# EasyEDA Pro project TJMakes_IO_Expander.eprj

# Schematic schematic1
Create Date: 2024-02-26; Page Name: P1; Project Name: TJMakes_IO_Expander; Schematic Name: schematic1; Update Date: 2024-02-26; Company: EasyEDA.com; Drawn: EasyEDA; Page Size: A4; Part Number: JLCPCB-002; Reviewed: EasyEDA; Version: V0.1
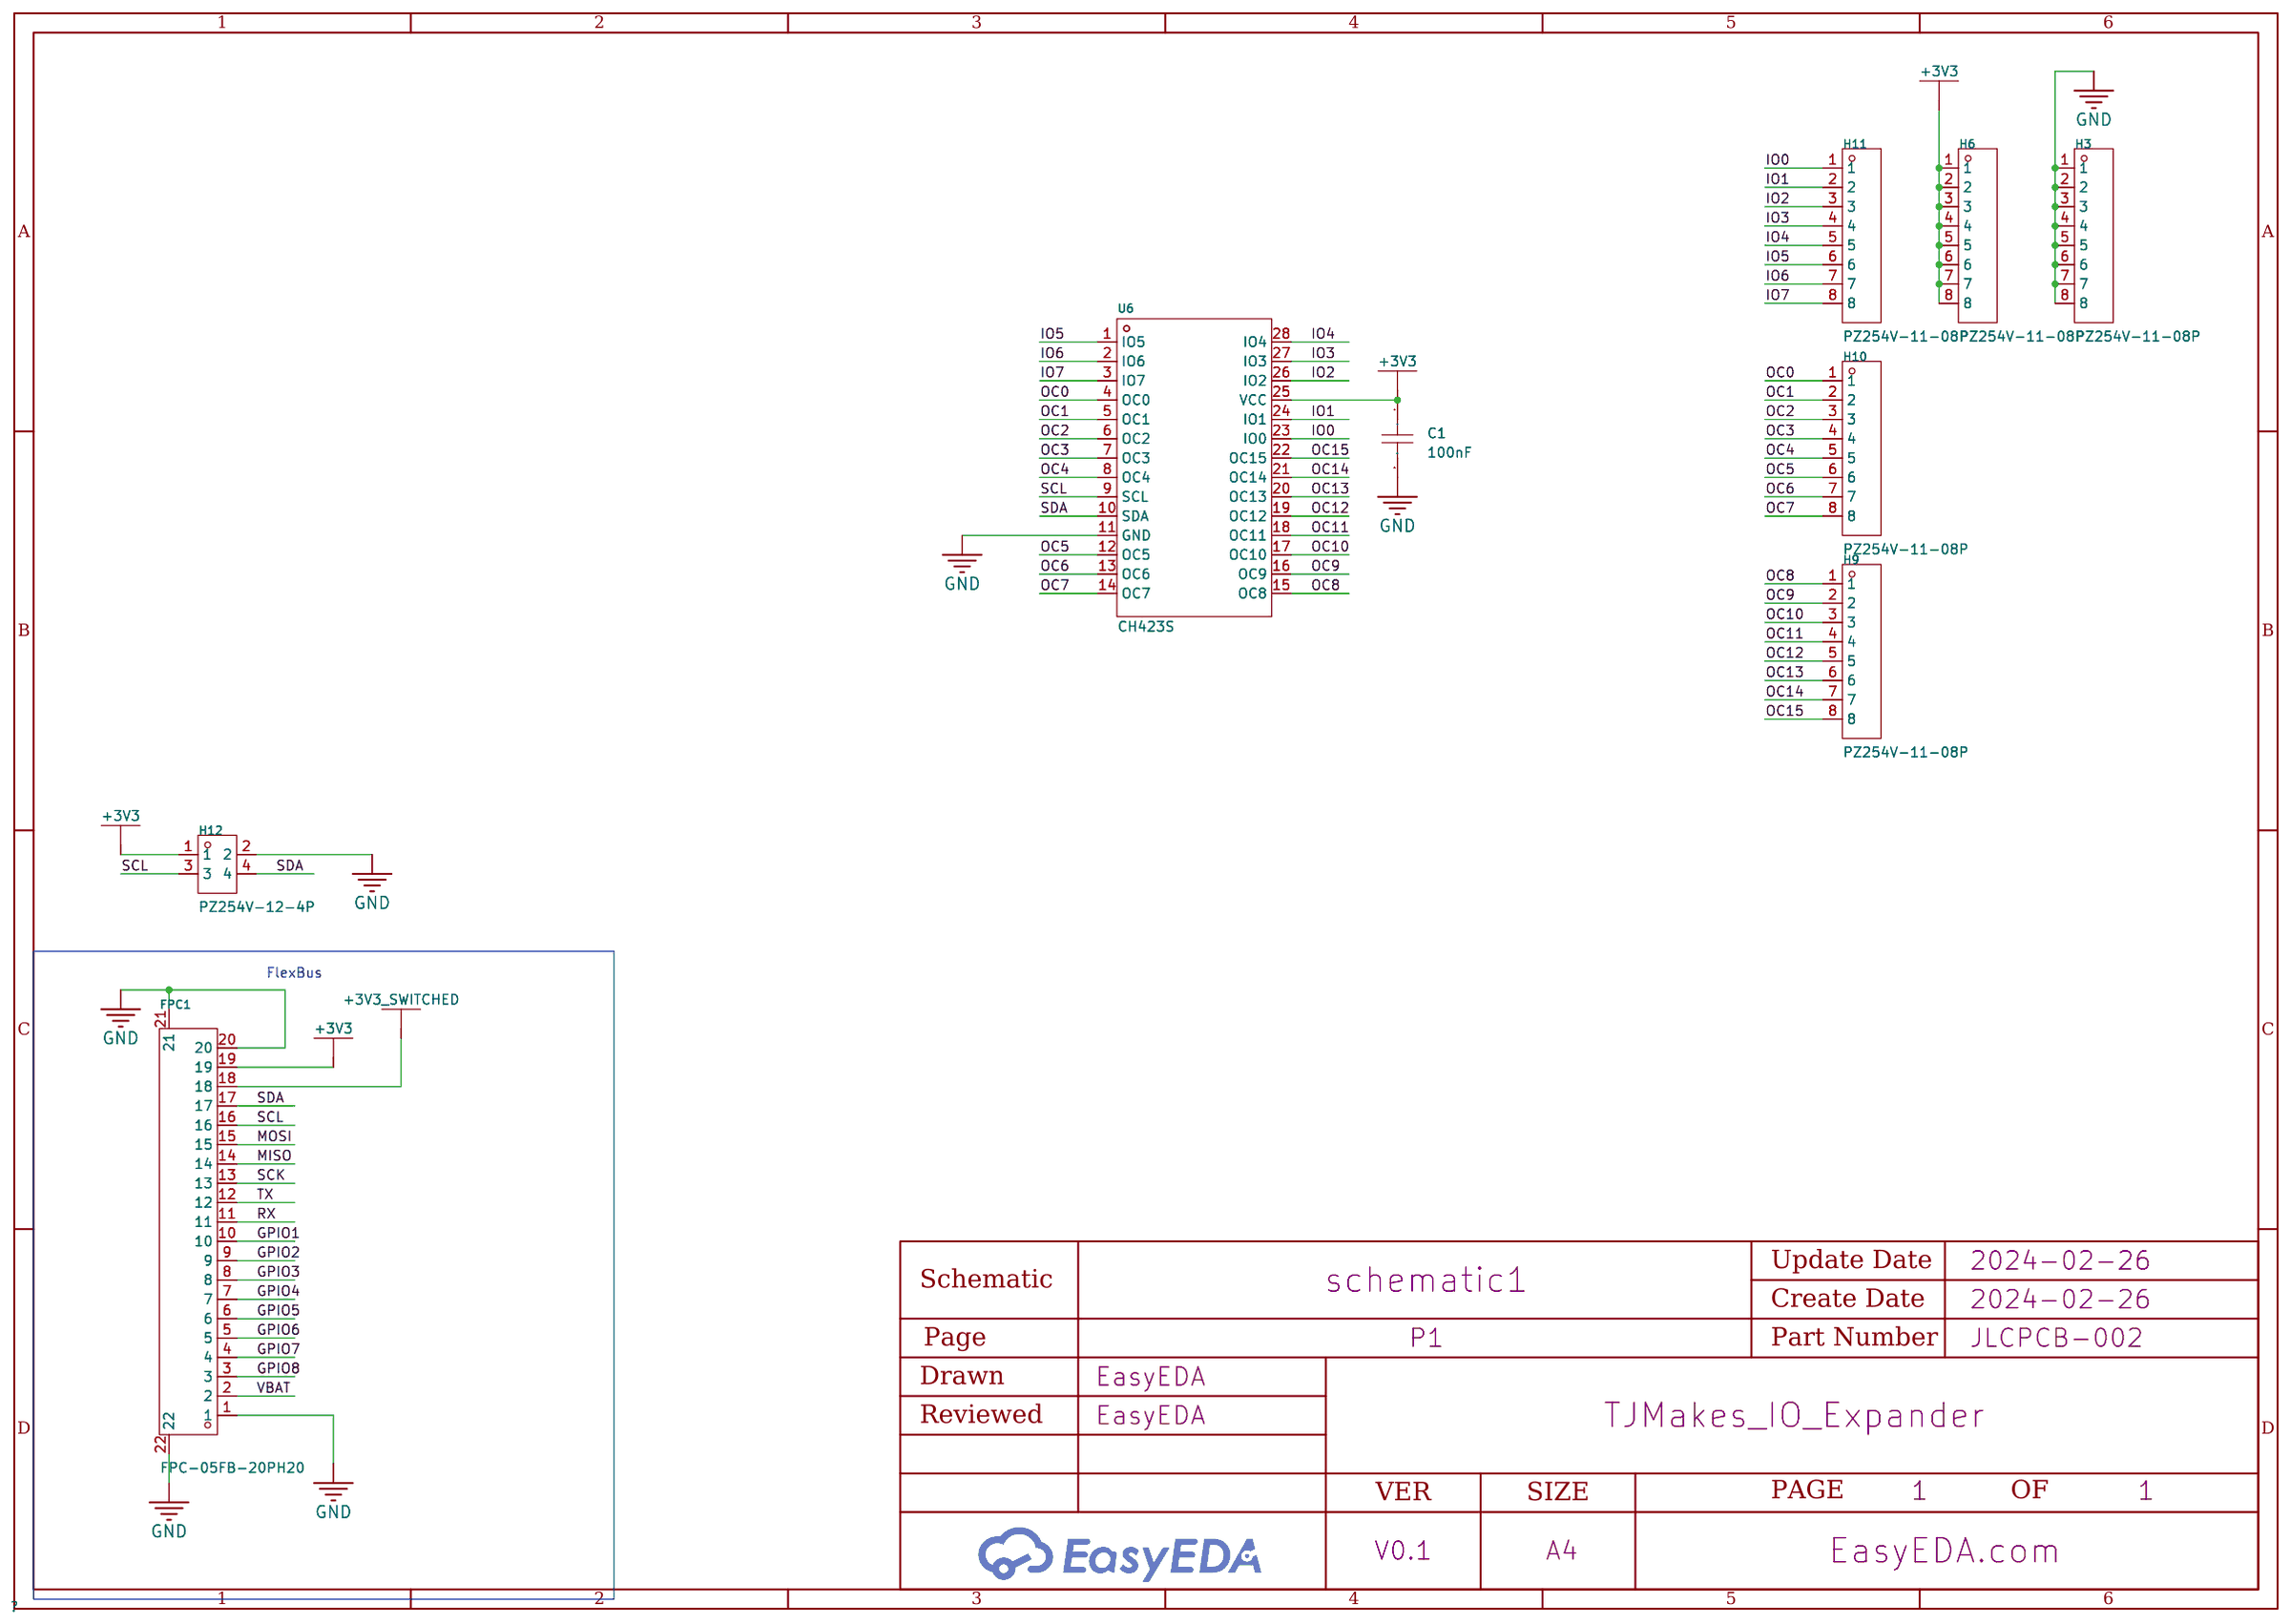
[diagram p0: schematic sheet]

## Parts
C1  100nF  [C0603]
FPC1  FPC-05FB-20PH20  [FPC-SMD_20P-P0.50_FPC-05FB-20PH20]
H3  PZ254V-11-08P  [HDR-TH_8P-P2.54-V-M]
H6  PZ254V-11-08P  [HDR-TH_8P-P2.54-V-M]
H9  PZ254V-11-08P  [HDR-TH_8P-P2.54-V-M]
H10  PZ254V-11-08P  [HDR-TH_8P-P2.54-V-M]
H11  PZ254V-11-08P  [HDR-TH_8P-P2.54-V-M]
H12  PZ254V-12-4P  [HDR-TH_4P-P2.54-V-M-R2-C2-S2.54]
U6  CH423S  [SOP-28_L17.9-W7.5-P1.27-LS10.3-BL]

## Library data of the parts
C1 = CAP_0603: Supplier Footprint: 0603
FPC1 = FPC-05FB-20PH20: Pitch:0.5mm Number of Contacts:20P Locking Feature:Clamshell FFC, FCB Thickness:0.3mm FFC, FCB Thickness:0.3mm Contact Type:Double-sided contacts/up and down connection Mounting Type:Surface Mount Height Above Board:2mm Operating Temperature Range:-25℃~+8; LCSC Part Name: 间距:0.5mm P数:20P 翻盖式 双侧触点/上下接; Supplier Part: C2856830; Manufacturer: XUNPU(讯普); Supplier Footprint: SMD,P=0.5mm,卧贴; JLCPCB Part Class: Extended Part; Datasheet: https://atta.szlcsc.com/upload/public/pdf/source/20210922/C2856830_32DC95BE77527398880E7D75F765EF2A.pdf; Supplier: LCSC; Pitch: 0.5mm; Number of Contacts: 20P; Locking Feature: Clamshell; FFC, FCB Thickness: 0.3mm; Contact Type: Double-sided contacts/up and down connection; Mounting Type: Surface Mount; Height Above Board: 2mm; Operating Temperature Range: -25℃~+85℃
H3 H6 H9-H11 = PZ254V-11-08P: Pin Structure:1x8P Pitch:2.54mm Row Spacing:- Circluar Pins/Square Pins:Square Pins Mounting Type:Straight Number of Rows:Plugin Number of Pins:8P Current Rating (Max):- Voltage Rating (Max):- Length of Mating Pin:6mm Insulation Height:2.5mm Length of End; LCSC Part Name: 间距:2.54mm 1x8P 直插 方针; Supplier Part: C492407; Manufacturer: XFCN(兴飞); Supplier Footprint: 插件,P=2.54mm; JLCPCB Part Class: Extended Part; Datasheet: https://atta.szlcsc.com/upload/public/pdf/source/20200309/C492407_83A6FB26A2233368EDB9516968EC6149.pdf; Supplier: LCSC; Pin Structure: 1x8P; Pitch: 2.54mm; Circluar Pins/Square Pins: Square Pins; Mounting Type: Straight; Number of Rows: Plugin; Number of Pins: 8P; Length of Mating Pin: 6mm; Insulation Height: 2.5mm; Length of End Connection Pin: 3mm; Operating Temperature Range: -40℃~+105℃; Color: Black
H12 = PZ254V-12-4P: Pin Structure:2x2P Pitch:2.54mm Row Spacing:2.54mm Circluar Pins/Square Pins:Square Pins Mounting Type:Straight Number of Rows:双排 Number of Pins:4P Current Rating (Max):- Voltage Rating (Max):- Length of Mating Pin:6mm Insulation Height:2.5mm Length of En; LCSC Part Name: 间距:2.54mm 2x2P 直插 方针; Supplier Part: C492419; Manufacturer: XFCN(兴飞); Supplier Footprint: 插件,P=2.54mm; JLCPCB Part Class: Extended Part; Datasheet: https://atta.szlcsc.com/upload/public/pdf/source/20200309/C492419_0001C06E73AFF21BD0ED3D7CEEF46D29.pdf; Supplier: LCSC; Pin Structure: 2x2P; Pitch: 2.54mm; Row Spacing: 2.54mm; Circluar Pins/Square Pins: Square Pins; Mounting Type: Straight; Number of Rows: 双排; Number of Pins: 4P; Length of Mating Pin: 6mm; Insulation Height: 2.5mm; Length of End Connection Pin: 3mm; Operating Temperature Range: -40℃~+105℃; Color: Black
U6 = CH423S: Interface:I2C； Number of I/O:8 Interrupt Output:无中断输出 Output Type: Clock Frequency:1MHz Supply Voltage:3V~5V Supply Voltage:3V~5V Operating Temperature:-40℃~+85℃ Operating Temperature:-40℃~+85℃; LCSC Part Name: 两线远程 I/O扩展芯片; Supplier Part: C111663; Manufacturer: WCH(南京沁恒); Supplier Footprint: SOP-28-300mil; JLCPCB Part Class: Extended Part; Datasheet: https://atta.szlcsc.com/upload/public/pdf/source/20200903/C111663_CD8D90B1FDB07543FB0EC296F501027C.pdf; Supplier: LCSC; Interface: I2C；; Number of I/O: 8; Interrupt Output: 无中断输出; Clock Frequency: 1MHz; Supply Voltage: 3V~5V; Operating Temperature: -40℃~+85℃

## Nets
+3V3: C1.1 FPC1.19 H6.1 H6.2 H6.3 H6.4 H6.5 H6.6 H6.7 H6.8 H12.1 U6.25(VCC)
+3V3_SWITCHED: FPC1.18
GND: C1.2 FPC1.1 FPC1.20 FPC1.21 FPC1.22 H3.1 H3.2 H3.3 H3.4 H3.5 H3.6 H3.7 H3.8 H12.2 U6.11(GND)
VBAT: FPC1.2
GPIO1: FPC1.10
GPIO2: FPC1.9
GPIO3: FPC1.8
GPIO4: FPC1.7
GPIO5: FPC1.6
GPIO6: FPC1.5
GPIO7: FPC1.4
GPIO8: FPC1.3
IO0: H11.1 U6.23(IO0)
IO1: H11.2 U6.24(IO1)
IO2: H11.3 U6.26(IO2)
IO3: H11.4 U6.27(IO3)
IO4: H11.5 U6.28(IO4)
IO5: H11.6 U6.1(IO5)
IO6: H11.7 U6.2(IO6)
IO7: H11.8 U6.3(IO7)
MISO: FPC1.14
MOSI: FPC1.15
OC0: H10.1 U6.4(OC0)
OC1: H10.2 U6.5(OC1)
OC2: H10.3 U6.6(OC2)
OC3: H10.4 U6.7(OC3)
OC4: H10.5 U6.8(OC4)
OC5: H10.6 U6.12(OC5)
OC6: H10.7 U6.13(OC6)
OC7: H10.8 U6.14(OC7)
OC8: H9.1 U6.15(OC8)
OC9: H9.2 U6.16(OC9)
OC10: H9.3 U6.17(OC10)
OC11: H9.4 U6.18(OC11)
OC12: H9.5 U6.19(OC12)
OC13: H9.6 U6.20(OC13)
OC14: H9.7 U6.21(OC14)
OC15: H9.8 U6.22(OC15)
RX: FPC1.11
SCK: FPC1.13
SCL: FPC1.16 H12.3 U6.9(SCL)
SDA: FPC1.17 H12.4 U6.10(SDA)
TX: FPC1.12

## Notes on the sheet
- FlexBus

# Board PCB1
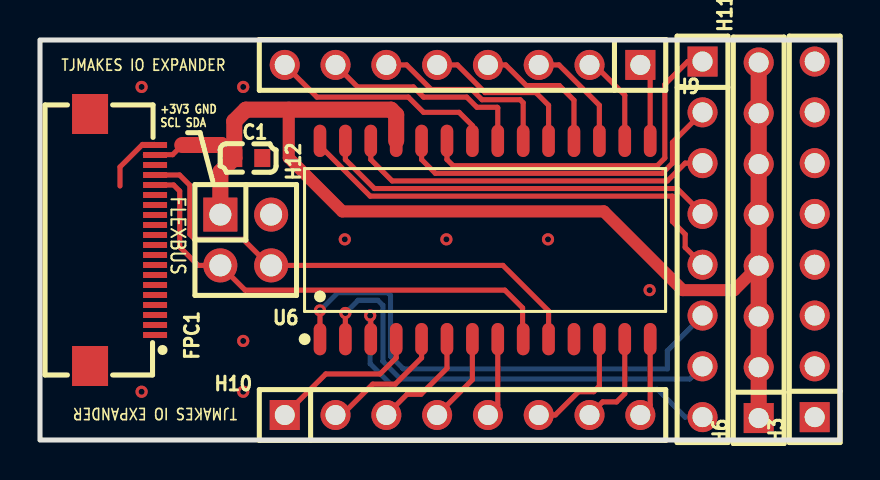
[diagram p1: board, top side]
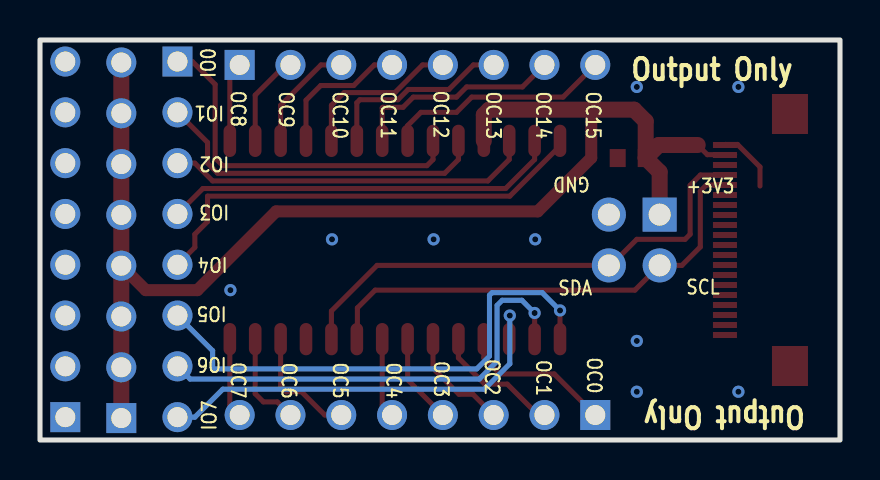
[diagram p2: board, bottom side, seen from below]

Outline 40 x 20 mm; copper layers: Top Layer, Bottom Layer. Coordinates in mm from the lower left corner of the outline.
Outline path: rectangle 0,20 40,0
Stack: Top Layer 0.035mm / Dielectric1 1.51mm FR4 er 4.5 / Bottom Layer 0.035mm

## Design rules (mm)
template: JLCPCB Capability(Two Layers Board)
spacing copperThickness1oz (default): track to track 0.102, other pairs 0.152 to 0.3
spacing copperThickness2oz: track to track 0.203, other pairs 0.152 to 0.3
track width copperThickness1oz (default): min 0.127, default 0.254, max 2.54
track width copperThickness2oz: min 0.203, default 0.254, max 2.54
differential pair differentialPair (default): width min 0.127, default 0.254, max 2.54; gap min 0.152, default 0.152
via viaSize (default): diameter min 0.5, default 0.61, max 10; hole min 0.3, default 0.305, max 6.3

## Placement (name value [footprint] x y rotation side)
C1  100nF  [C0603]  10.41 14.1 0 top
FPC1  FPC-05FB-20PH20  [FPC-SMD_20P-P0.50_FPC-05FB-20PH20]  4.13 10 270 top
H3  PZ254V-11-08P  [HDR-TH_8P-P2.54-V-M]  38.74 10.03 90 top
H6  PZ254V-11-08P  [HDR-TH_8P-P2.54-V-M]  35.94 9.99 90 top
H9  PZ254V-11-08P  [HDR-TH_8P-P2.54-V-M]  21.13 18.75 180 top
H10  PZ254V-11-08P  [HDR-TH_8P-P2.54-V-M]  21.13 1.25 0 top
H11  PZ254V-11-08P  [HDR-TH_8P-P2.54-V-M]  33.13 10.03 270 top
H12  PZ254V-12-4P  [HDR-TH_4P-P2.54-V-M-R2-C2-S2.54]  10.29 10 270 top
U6  CH423S  [SOP-28_L17.9-W7.5-P1.27-LS10.3-BL]  22.25 10 0 top

## Footprints (pads in the part's own frame, mm; a bottom-side part is the same pattern mirrored in y, then rotated)
C0603
  rect 0.8x0.9 smd: 1(-0.7,0) 2(0.7,0)
FPC-SMD_20P-P0.50_FPC-05FB-20PH20
  rect 0.3x1.2 smd: 1(4.75,1.625) 2(4.25,1.625) 3(3.75,1.625) 4(3.25,1.625) 5(2.75,1.625) 6(2.25,1.625) 7(1.75,1.625) 8(1.25,1.625) 9(0.75,1.625) 10(0.25,1.625) 11(-0.25,1.625) 12(-0.75,1.625) 13(-1.25,1.625) 14(-1.75,1.625) 15(-2.25,1.625) 16(-2.75,1.625) 17(-3.25,1.625) 18(-3.75,1.625) 19(-4.25,1.625) 20(-4.75,1.625)
  rect 2x1.8 smd: 21(-6.3,-1.625) 22(6.3,-1.625)
HDR-TH_4P-P2.54-V-M-R2-C2-S2.54
  rect 1.7x1.7 hole 1.1: 1(-1.27,-1.27)
  round 1.7 hole 1.1: 2(-1.27,1.27) 3(1.27,-1.27) 4(1.27,1.27)
HDR-TH_8P-P2.54-V-M
  rect 1.5x1.5 hole 1: 1(-8.89,0)
  round 1.5 hole 1: 2(-6.35,0) 3(-3.81,0) 4(-1.27,0) 5(1.27,0) 6(3.81,0) 7(6.35,0) 8(8.89,0)
SOP-28_L17.9-W7.5-P1.27-LS10.3-BL
  oval 0.63x1.615 smd: 1(-8.255,-4.957) 2(-6.985,-4.957) 3(-5.715,-4.957) 4(-4.445,-4.957) 5(-3.175,-4.957) 6(-1.905,-4.957) 7(-0.635,-4.957) 8(0.635,-4.957) 9(1.905,-4.957) 10(3.175,-4.957) 11(4.445,-4.957) 12(5.715,-4.957) 13(6.985,-4.957) 14(8.255,-4.957) 15(8.255,4.957) 16(6.985,4.957) 17(5.715,4.957) 18(4.445,4.957) 19(3.175,4.957) 20(1.905,4.957) 21(0.635,4.957) 22(-0.635,4.957) 23(-1.905,4.957) 24(-3.175,4.957) 25(-4.445,4.957) 26(-5.715,4.957) 27(-6.985,4.957) 28(-8.255,4.957)

## Nets
As in the schematic.

## Via types
v1: diameter 0.61, hole 0.304, Top Layer to Bottom Layer, 9 vias
v2: diameter 0.61, hole 0.305, Top Layer to Bottom Layer, 3 vias

## Routing (per net, layer and track width the routed paths; a pad name or vN(x,y) marks a point on that pad's centre or on a via; arc(x,y) is an arc through that point)
+3V3: length 66.5
  Top Layer w0.254: 7.12,14.75 6.63,14.27 5.27,14.27
  Top Layer w0.6: H6.4 34.71,7.49 32.13,7.49 28.19,11.43 15.11,11.43 12.44,14.11 12.44,16.52
  Top Layer w0.8: C1.1 9.02,13.4 H12.1 ; C1.1 9.06,14.75 7.12,14.75 ; C1.1 9.71,15.94 10.29,16.52 17.55,16.52 17.81,16.26 U6.25 ; H6.8 H6.7 H6.6 H6.5 H6.4 H6.3 H6.2 H6.1
GND: length 3.2
  Top Layer w0.254: FPC1.20 5.72,14.78 5.13,14.78 4,13.65 4,12.7
  vias: v1(5.08,17.65) v1(5.08,2.41) v1(10.16,17.65) v1(10.16,4.95) v1(10.16,2.41) v1(15.24,10.03) v1(20.32,10.03) v1(25.4,10.03) v1(30.48,7.49)
IO0: length 18.2
  Top Layer w0.254: H11.1 32.39,18.92 31.24,17.78 31.24,14.1 30.86,13.72 20.66,13.72 20.35,14.02 U6.23
IO1: length 17.1
  Top Layer w0.254: U6.24 19.08,14.02 19.77,13.33 31.12,13.33 31.62,13.84 31.62,14.88 H11.2
IO2: length 18.3
  Top Layer w0.254: H11.3 32.26,13.84 31.37,12.95 17.61,12.95 16.54,14.02 U6.26
IO3: length 19.9
  Top Layer w0.254: U6.27 15.27,14.02 16.72,12.57 31.86,12.57 H11.4
IO4: length 23
  Top Layer w0.254: H11.5 32.26,9.63 32.26,10.29 31.62,10.92 31.62,12.19 16.51,12.19 14,14.7 U6.28
IO5: length 25.9
  Top Layer w0.254: U6.1 v2(14,6.48)
  Bottom Layer w0.254: H11.6 31.37,4.47 31.37,3.56 18.16,3.56 17.53,4.19 17.53,7.24 17.4,7.37 14.89,7.37 v2(14,6.48)
IO6: length 23
  Top Layer w0.254: U6.2 v2(15.27,6.35)
  Bottom Layer w0.254: v2(15.27,6.35) 15.9,6.98 16.89,6.98 17.15,6.73 17.15,3.94 18.03,3.05 32.49,3.05 H11.7
IO7: length 21.3
  Top Layer w0.254: v2(16.51,6.22) 16.54,6.19 U6.3
  Bottom Layer w0.254: H11.8 32.26,1.14 30.86,2.54 17.78,2.54 16.51,3.81 v2(16.51,6.22)
OC0: length 7.7
  Top Layer w0.254: H10.1 14.29,3.3 17,3.3 17.81,4.11 U6.4
OC1: length 6.4
  Top Layer w0.254: H10.2 15.09,1.25 16.64,2.79 17.77,2.79 19.08,4.11 U6.5
OC2: length 5.5
  Top Layer w0.254: H10.3 18.35,2.29 19.05,2.29 20.35,3.58 U6.6
OC3: length 4.5
  Top Layer w0.254: H10.4 21.62,3.01 U6.7
OC4: length 4
  Top Layer w0.254: H10.5 22.89,1.74 U6.8
OC5: length 6
  Top Layer w0.254: U6.12 27.97,2.7 27.69,2.41 26.92,2.41 25.76,1.25 H10.6
OC6: length 4.9
  Top Layer w0.254: U6.13 29.24,2.31 28.83,1.91 28.13,1.91 H10.7
OC7: length 4
  Top Layer w0.254: U6.14 30.51,1.74 H10.8
OC8: length 4
  Top Layer w0.254: U6.15 30.51,18.26 H9.1
OC9: length 4.7
  Top Layer w0.254: U6.16 29.24,17.24 27.73,18.75 H9.2
OC10: length 5.6
  Top Layer w0.254: H9.3 25.95,18.75 27.97,16.73 U6.17
OC11: length 7.1
  Top Layer w0.254: H9.4 23.28,18.75 24.31,17.72 25.96,17.72 26.7,16.99 U6.18
OC12: length 8.2
  Top Layer w0.254: U6.19 25.43,16.73 24.8,17.37 22.25,17.37 20.87,18.75 H9.5
OC13: length 9.5
  Top Layer w0.254: H9.6 18.33,18.75 19.56,17.53 21.59,17.53 22.1,17.01 24.01,17.01 24.16,16.86 U6.20
OC14: length 10.7
  Top Layer w0.254: U6.21 22.89,16.61 22.86,16.64 21.84,16.64 21.34,17.14 19.18,17.14 18.67,17.65 15.88,17.65 H9.7
OC15: length 11.4
  Top Layer w0.254: U6.22 21.62,15.72 20.96,16.38 19.18,16.38 18.42,17.14 13.85,17.14 H9.8
SCL: length 24.1
  Top Layer w0.254: FPC1.16 6.68,12.75 6.99,12.45 6.99,9.65 7.91,8.73 H12.3 10.25,7.49 23.24,7.49 24.13,6.6 24.13,5.07 U6.9
SDA: length 25.3
  Top Layer w0.254: U6.10 25.43,6.45 23.15,8.73 H12.4 11.46,8.73 10.16,10.03 7.75,10.03 7.49,10.29 7.49,12.74 6.98,13.25 FPC1.17

## Copper pours and planes (outline as drawn; the poured copper is in the pictures)
GND on Top Layer: 0,20 40,20 40,-0.13 0,-0.13
GND on Bottom Layer: 0,20 40,20 40,0 0,0

## Text on the board
Bottom Silkscreen Layer: +3V3 | SDA | OC0 | OC15 | OC1 | OC14 | OC13 | OC2 | OC3 | OC12 | OC4 | OC11 | OC5 | OC10 | OC6 | OC9 | OC8 | OC7 | GND | IO2 | IO3 | IO4 | IO5 | IO1 | SCL | IO6 | IO7 | IO0 | Output Only
Top Silkscreen Layer: +3V3 GND / SCL SDA | TJMAKES IO EXPANDER | FLEXBUS
